# Altium schematic sheet ProcessorSupport.SchDoc
size 420 x 297 mm; SheetNumber: 6; SheetTotal: 14; PageSetup: Record=PageOptions|CenterHorizontal=True|CenterVertical=True|PrintScale=0.96|XCorrection=1.00|YCorrection=1.00|PrintKind=1|BorderSize=5000000|LeftOffset=0|BottomOffset=0|Orientation=2|PaperLength=4318|PaperWidth=2794|Scale=100|PaperSource=7|PrintQuality=600|MediaType=1|DitherType=10|PaperKind=11" x 17"|PrintScaleMode=1
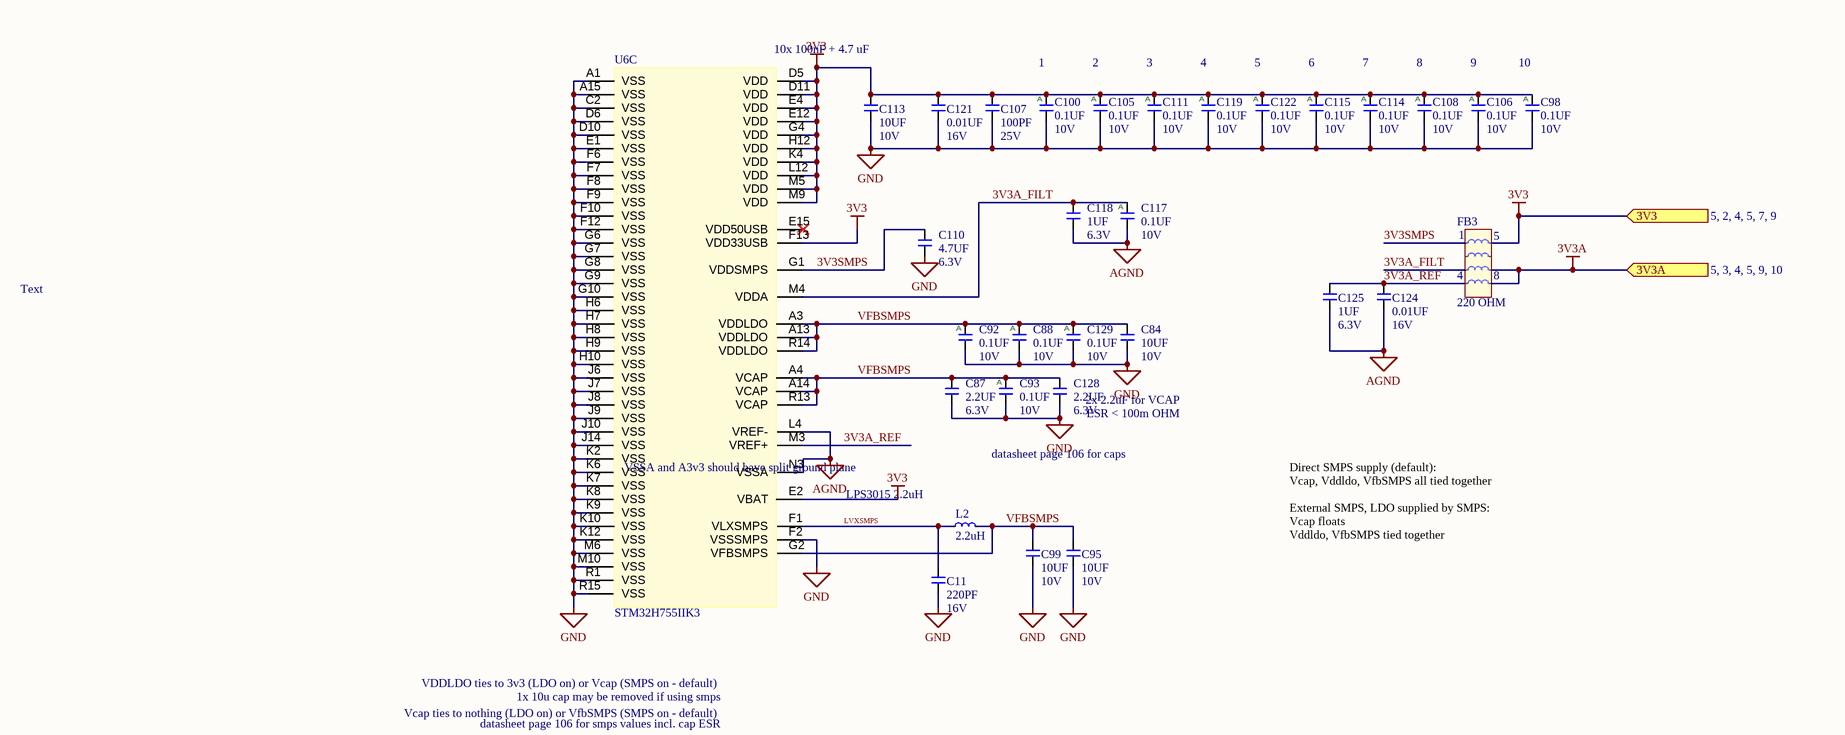
[diagram p0: ProcessorSupport.SchDoc]

## Parts
C11  value 220PF  Voltage: 16V  [C0201]  (hidden comment: __Template_Cap)
C84  value 10UF  Voltage: 10V  [C0402]  (hidden comment: __Template_Cap)
C87  value 2.2UF  Voltage: 6.3V  [C0201]  (hidden comment: __Template_Cap)
C88  value 0.1UF  Voltage: 10V  [C0201]  (hidden comment: __Template_Cap_Auto)
C92  value 0.1UF  Voltage: 10V  [C0201]  (hidden comment: __Template_Cap_Auto)
C93  value 0.1UF  Voltage: 10V  [C0201]  (hidden comment: __Template_Cap_Auto)
C95  value 10UF  Voltage: 10V  [C0402]  (hidden comment: __Template_Cap)
C98  value 0.1UF  Voltage: 10V  [C0201]  (hidden comment: __Template_Cap_Auto)
C99  value 10UF  Voltage: 10V  [C0402]  (hidden comment: __Template_Cap)
C100  value 0.1UF  Voltage: 10V  [C0201]  (hidden comment: __Template_Cap_Auto)
C105  value 0.1UF  Voltage: 10V  [C0201]  (hidden comment: __Template_Cap_Auto)
C106  value 0.1UF  Voltage: 10V  [C0201]  (hidden comment: __Template_Cap_Auto)
C107  value 100PF  Voltage: 25V  [C0201]  (hidden comment: __Template_Cap)
C108  value 0.1UF  Voltage: 10V  [C0201]  (hidden comment: __Template_Cap_Auto)
C110  value 4.7UF  Voltage: 6.3V  [C0402]  (hidden comment: __Template_Cap)
C111  value 0.1UF  Voltage: 10V  [C0201]  (hidden comment: __Template_Cap_Auto)
C113  value 10UF  Voltage: 10V  [C0402]  (hidden comment: __Template_Cap)
C114  value 0.1UF  Voltage: 10V  [C0201]  (hidden comment: __Template_Cap_Auto)
C115  value 0.1UF  Voltage: 10V  [C0201]  (hidden comment: __Template_Cap_Auto)
C117  value 0.1UF  Voltage: 10V  [C0201]  (hidden comment: __Template_Cap_Auto)
C118  value 1UF  Voltage: 6.3V  [C0201]  (hidden comment: __Template_Cap)
C119  value 0.1UF  Voltage: 10V  [C0201]  (hidden comment: __Template_Cap_Auto)
C121  value 0.01UF  Voltage: 16V  [C0201]  (hidden comment: __Template_Cap)
C122  value 0.1UF  Voltage: 10V  [C0201]  (hidden comment: __Template_Cap_Auto)
C124  value 0.01UF  Voltage: 16V  [C0201]  (hidden comment: __Template_Cap)
C125  value 1UF  Voltage: 6.3V  [C0201]  (hidden comment: __Template_Cap)
C128  value 2.2UF  Voltage: 6.3V  [C0201]  (hidden comment: __Template_Cap)
C129  value 0.1UF  Voltage: 10V  [C0201]  (hidden comment: __Template_Cap_Auto)
FB3  value 220 OHM  [FB_ARRAY_BLA31AG221SN4D]  (hidden comment: FB_ARRAY_BLA31AG221SN4D)
L2  value 2.2uH  [IND_LPS3015-152MRB]  (hidden comment: __Template_Inductor)
U6  MFG P/N: STM32H755IIK3  [BGS201C65P15X15_1000X1000X60]  (hidden comment: MCU_STM32H755IIK3)  (part C of 3)

## Ports
3V3 (in, see 5, 2, 4, 5, 7, 9), 3V3A (in, see 5, 3, 4, 5, 9, 10)

## Nets
3V3: C98.1 C100.1 C105.1 C106.1 C107.1 C108.1 C111.1 C113.1 C114.1 C115.1 C119.1 C121.1 C122.1 FB3.5 U6.D5(VDD) U6.D11(VDD) U6.E2(VBAT) U6.E4(VDD) U6.E12(VDD) U6.F13(VDD33USB) U6.G4(VDD) U6.H12(VDD) U6.K4(VDD) U6.L12(VDD) U6.M5(VDD) U6.M9(VDD) ; port 3V3
3V3A: FB3.7 FB3.8 ; port 3V3A
AGND: C117.2 C118.2 C124.2 C125.2 U6.L4(VREF-) U6.N3(VSSA)
GND: C11.2 C84.2 C87.2 C88.2 C92.2 C93.2 C95.1 C98.2 C99.1 C100.2 C105.2 C106.2 C107.2 C108.2 C110.2 C111.2 C113.2 C114.2 C115.2 C119.2 C121.2 C122.2 C128.2 C129.2 U6.A1(VSS) U6.A15(VSS) U6.C2(VSS) U6.D6(VSS) U6.D10(VSS) U6.E1(VSS) U6.F2(VSSSMPS) U6.F6(VSS) U6.F7(VSS) U6.F8(VSS) U6.F9(VSS) U6.F10(VSS) U6.F12(VSS) U6.G6(VSS) U6.G7(VSS) U6.G8(VSS) U6.G9(VSS) U6.G10(VSS) U6.H6(VSS) U6.H7(VSS) U6.H8(VSS) U6.H9(VSS) U6.H10(VSS) U6.J6(VSS) U6.J7(VSS) U6.J8(VSS) U6.J9(VSS) U6.J10(VSS) U6.J14(VSS) U6.K2(VSS) U6.K6(VSS) U6.K7(VSS) U6.K8(VSS) U6.K9(VSS) U6.K10(VSS) U6.K12(VSS) U6.M6(VSS) U6.M10(VSS) U6.R1(VSS) U6.R15(VSS)
3V3A_FILT: C117.1 C118.1 FB3.3 U6.M4(VDDA)
3V3A_REF: C124.1 C125.1 FB3.4 U6.M3(VREF+)
3V3SMPS: C110.1 FB3.1 U6.G1(VDDSMPS)
LVXSMPS: C11.1 L2.1 U6.F1(VLXSMPS)
VFBSMPS: C84.1 C87.1 C88.1 C92.1 C93.1 C95.2 C99.2 C128.1 C129.1 L2.2 U6.A3(VDDLDO) U6.A4(VCAP) U6.A13(VDDLDO) U6.A14(VCAP) U6.G2(VFBSMPS) U6.R13(VCAP) U6.R14(VDDLDO)

Not connected (* = marked no-connect by the designer): FB3 2 6; U6 E15(VDD50USB)*

## Notes on the sheet
- 10x 100nF + 4.7 uF
- (near C100) 1
- (near C105) 2
- (near C111) 3
- (near C119) 4
- (near C122) 5
- (near C115) 6
- (near C114) 7
- (near C108) 8
- (near C106) 9
- (near C98) 10
- Text
- 2x 2.2uF for VCAP
- VSSA and A3v3 should have split ground plane
- datasheet page 106 for caps
- ESR < 100m OHM
- (near L2) LPS3015 2.2uH
- Direct SMPS supply (default):
  Vcap, Vddldo, VfbSMPS all tied together
  External SMPS, LDO supplied by SMPS:
  Vcap floats
  Vddldo, VfbSMPS tied together
- VDDLDO ties to 3v3 (LDO on) or Vcap (SMPS on - default)
- Vcap ties to nothing (LDO on) or VfbSMPS (SMPS on - default)
- 1x 10u cap may be removed if using smps
- datasheet page 106 for smps values incl. cap ESR
- CREATIVE COMMONS
- PUBLIC LICENSE:
- BARKOUR ROBOT
- CC BY-NC 4.0
- APPROVED
- DWG NO
- GOOGLE LLC
- FILE
- RELEASED
- 2024/05/09
- SIZE
- 1600 AMPHITHEATRE PARKWAY
- MOUNTAIN VIEW CA 94043
- A3
- SHEET
- OF
- THIS DESIGN IS BEING PROVIDED  FOR NON-COMMERCIAL USE ONLY. THE USE OF =SCIENTIST_NAME_POSSESSIVE NAME IN CONNECTION WITH THE DESIGN IS NOT INTENDED TO IMPLY THAT =SCIENTIST_NAME SPONSORS OR ENDORSES THE DESIGN, GOOGLE LLC, OR ANY OF GOOGLE LLC'S PRODUCTS OR SERVICES.
- (in symbol 934) A

## Library data of the parts
C11 = 156: CAP, CER, X7R, 220pF, 16V, 10%, 0201, 0.33mm T; MFG: MURATA; MFG P/N: GRM033R71C221KA01D; COMMON: 150-00794-00; Status: Released; Package: 0201; Supplier 1: Digi-Key; ComponentLink1URL: https://www.digikey.com/en/products/detail/murata-electronics/GRM033R71C221KA01D/2543508; Supplier Part Number 1: 490-6149-1-ND
C84 C95 C99 C113 = 215: CAP, CER, X5R, 10uF, 10V, 20%, 0402, 0.7mm T; MFG: SAMSUNG; MFG P/N: CL05A106MP5NUNC; COMMON: 150-00376-00; Status: Released; Package: 0402; Supplier 1: Digi-Key; ComponentLink1URL: https://www.digikey.com/en/products/detail/samsung-electro-mechanics/CL05A106MP5NUNC/3887108; Supplier Part Number 1: 1276-1450-1-ND
C87 C128 = 110: CAP, CER, X5R, 2.2uF, 6.3V, 20%, 0201, 0.39mm T; MFG: SAMSUNG; MFG P/N: CL03A225MQ3CRNC; COMMON: 150-00421-00; Status: Released; Package: 0201; Supplier 1: Digi-Key; ComponentLink1URL: https://www.digikey.com/en/products/detail/samsung-electro-mechanics/CL03A225MQ3CRNC/5961354; Supplier Part Number 1: 1276-6870-1-ND
C88 C92 C93 C98 C100 C105 C106 C108 C111 C114 C115 C117 C119 C122 C129 = 934: CAP, CER, X6S, 0.1uF, 10V, 10%, 0201, AUTOGRADE; MFG: MURATA; MFG P/N: GRT033C81A104KE01D; COMMON: 150-01178-00; Status: Released; Package: 0201; Supplier 1: Digi-key; ComponentLink1URL: https://search.murata.co.jp/Ceramy/image/img/A01X/G101/ENG/GRT033C81A104KE01-01.pdf; Supplier Part Number 1: 490-12232-1-ND
C107 = 767: CAP, CER, X7R, 100pF, 25V, 10%, 0201, 0.33mm T; MFG: MURATA; MFG P/N: GRM033R71E101KA01D; COMMON: 150-00022-00; Status: Released; Package: 0201; Supplier 1: Digi-Key; ComponentLink1URL: https://www.digikey.com/en/products/detail/murata-electronics/GRM033R71E101KA01D/702438; Supplier Part Number 1: 490-3172-1-ND
C110 = 50: CAP, CER, X5R, 4.7uF, 20%, 6.3V, 0402, 0.65mm; MFG: TDK; MFG P/N: C1005X5R0J475M050BC; COMMON: 150-00023-00; Status: Released; Package: 0402; Supplier 1: Digi-Key; ComponentLink1URL: https://www.digikey.com/en/products/detail/tdk-corporation/C1005X5R0J475M050BC/2732830; Supplier Part Number 1: 445-7395-1-ND
C118 C125 = 240: CAP, CER, X5R, 1uF, 6.3V, 20%, 0201, 0.33mm T; MFG: SAMSUNG; MFG P/N: CL03A105MQ3CSNC; COMMON: 150-00980-00; Status: Released; Package: 0201; Supplier 1: Digi-Key; ComponentLink1URL: https://www.digikey.com/en/products/detail/samsung-electro-mechanics/CL03A105MQ3CSNC/3886983; Supplier Part Number 1: 1276-1325-1-ND
C121 C124 = 361: CAP, CER, X5R, 0.01uF, 16V, 10%, 0201, 0.33mm T; MFG: MURATA; MFG P/N: GRM033R61C103KA12D; COMMON: 150-00126-00; Status: Released; Package: 0201; Supplier 1: Digi-Key; ComponentLink1URL: https://www.digikey.com/en/products/detail/murata-electronics/GRM033R61C103KA12D/4213197; Supplier Part Number 1: 490-7223-1-ND
FB3 = 937: FERRITE, BEAD, 220 OHM, 150mA, DCR 0.25 MAX, 1206; MFG: Murata Electronics; Status: Released; MFG P/N: BLA31AG221SN4D; Package: 1206-Array; Supplier 1: Digi-Key; ComponentLink1URL: https://www.murata.com/en-us/products/productdata/8796743204894/ENFA0008.pdf; Supplier Part Number 1: 490-9700-1-ND
L2 = 939: IND, WIREWOUND, SHIELDED, 2.2uH, 2.1A, 20%, DCR 0.11, SMD, AUTOGRADE; MFG: COILCRAFT; MFG P/N: LPS3015-222MR_; Status: Released; Package: 2 - pin SMD; Supplier 1: Digi-Key; ComponentLink1URL: https://www.coilcraft.com/getmedia/5d262731-85ef-4348-8ab4-1044b4fc3cb8/lps3015.pdf; Supplier Part Number 1: 2457-LPS3015-222MR_TR-ND
U6 = 112: IC, MCU, STM32H755xI, ARM, 32-BIT, 240MHZ, 128 I/O, 2MB, FLASH, 1.62V TO 3.6V, UFBGA-201; MFG: STMicroelectronics; Value: BGS201C65P15X15_1000X1000X60; Status: Released; Package: 176+25UFBGA (10x10); Supplier 1: Digi-Key; ComponentLink1URL: https://www.st.com/resource/en/datasheet/stm32h755ii.pdf; Supplier Part Number 1: 497-STM32H755IIK3-ND